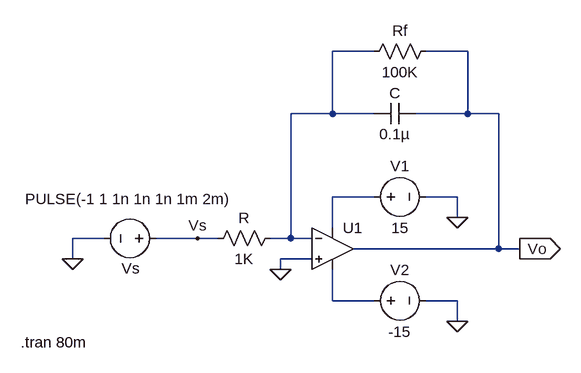
[diagram p0: schematic Run2_A.asc]
Run2_A.asc, the LTspice schematic file:
Version 4
SHEET 1 1240 788
WIRE 928 320 864 320
WIRE 1072 320 1008 320
WIRE 864 416 864 320
WIRE 864 416 800 416
WIRE 928 416 864 416
WIRE 1072 416 1072 320
WIRE 1072 416 992 416
WIRE 1120 416 1072 416
WIRE 928 544 864 544
WIRE 1056 544 1008 544
WIRE 1056 576 1056 544
WIRE 864 592 864 544
WIRE 512 608 464 608
WIRE 656 608 592 608
WIRE 688 608 656 608
WIRE 800 608 800 416
WIRE 800 608 768 608
WIRE 832 608 800 608
WIRE 1120 624 1120 416
WIRE 1120 624 896 624
WIRE 1152 624 1120 624
WIRE 464 640 464 608
WIRE 832 640 784 640
WIRE 784 656 784 640
WIRE 864 704 864 656
WIRE 928 704 864 704
WIRE 1056 704 1008 704
WIRE 1056 736 1056 704
FLAG 1056 576 0
FLAG 1056 736 0
FLAG 464 640 0
FLAG 784 656 0
FLAG 1152 624 Vo
IOPIN 1152 624 Out
FLAG 656 608 Vs
SYMBOL OpAmps\\UniversalOpamp2 864 624 R0
SYMATTR InstName U1
SYMBOL voltage 912 544 R270
WINDOW 0 32 56 VTop 2
WINDOW 3 -32 56 VBottom 2
WINDOW 123 0 0 Left 0
WINDOW 39 0 0 Left 0
SYMATTR InstName V1
SYMATTR Value 15
SYMBOL voltage 912 704 R270
WINDOW 0 32 56 VTop 2
WINDOW 3 -32 56 VBottom 2
WINDOW 123 0 0 Left 0
WINDOW 39 0 0 Left 0
SYMATTR InstName V2
SYMATTR Value -15
SYMBOL res 784 592 R90
WINDOW 0 0 56 VBottom 2
WINDOW 3 32 56 VTop 2
SYMATTR InstName R
SYMATTR Value 1K
SYMBOL voltage 608 608 R90
WINDOW 0 62 55 VBottom 2
WINDOW 3 -76 58 VTop 2
WINDOW 123 0 0 Left 0
WINDOW 39 0 0 Left 0
SYMATTR InstName Vs
SYMATTR Value PULSE(-1 1 1n 1n 1n 1m 2m)
SYMBOL cap 992 400 R90
WINDOW 0 0 32 VBottom 2
WINDOW 3 32 32 VTop 2
SYMATTR InstName C
SYMATTR Value 0.1µ
SYMBOL res 1024 304 R90
WINDOW 0 0 56 VBottom 2
WINDOW 3 32 56 VTop 2
SYMATTR InstName Rf
SYMATTR Value 100K
TEXT 384 768 Left 2 !.tran 80m

The netlist it stands for:
* Run2_A.asc
XU1 0 N001 N002 N003 Vo level.2 Avol=1Meg GBW=10Meg Slew=10Meg ilimit=25m rail=0 Vos=0 phimargin=45 en=0 enk=0 in=0 ink=0 Rin=500Meg  ; pins IN+ IN- V+ V- OUT
V1 N002 0 15
V2 N003 0 -15
R N001 Vs 1K
Vs Vs 0 PULSE(-1 1 1n 1n 1n 1m 2m)
C Vo N001 0.1µ
Rf Vo N001 100K
.tran 80m
.lib UniversalOpamps2.sub
.backanno
.end